# EAGLE design micro_schem (EAGLE 5.04)
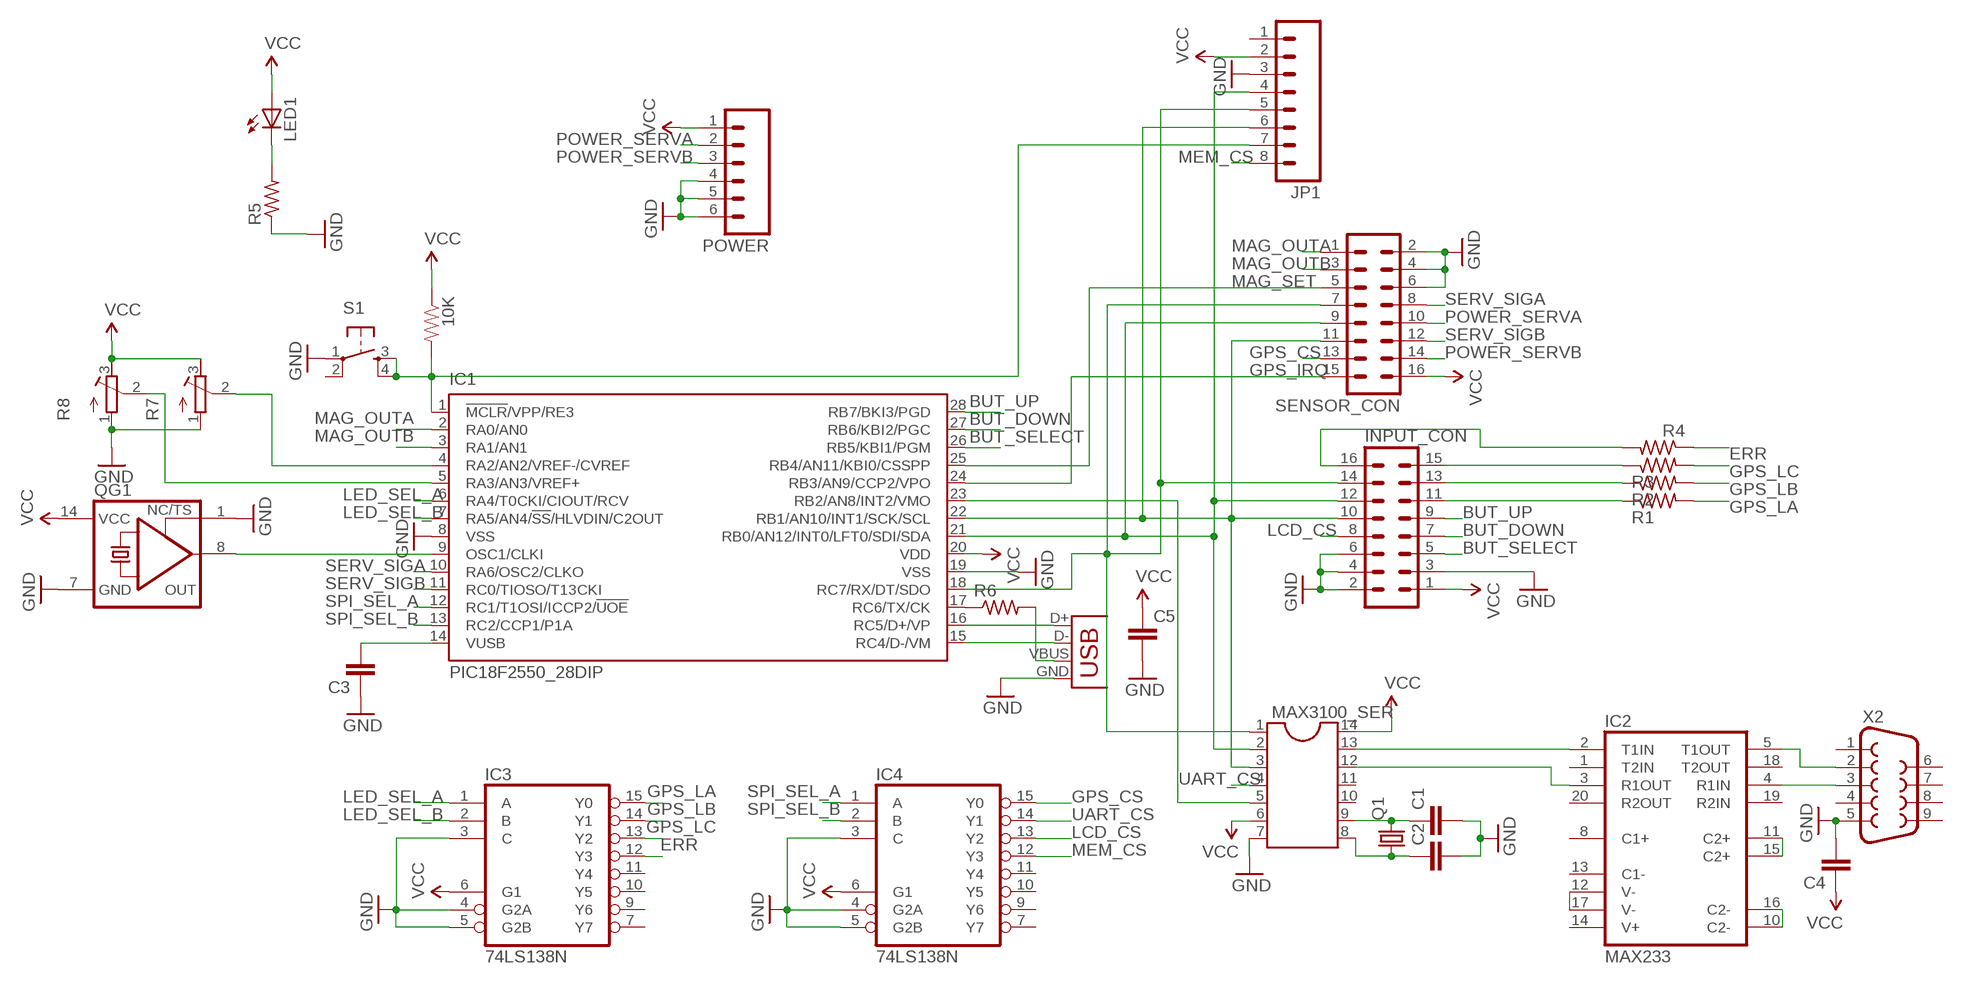
[diagram p0: schematic, sheet 1]

## Parts
10K  RESISTORPTH1  [AXIAL-0.3]
C1  CAPPTH  [CAP-PTH-SMALL]
C2  CAPPTH  [CAP-PTH-SMALL]
C3  CAPPTH  [CAP-PTH-SMALL]
C4  CAPPTH2  [CAP-PTH-SMALL2]
C5  CAPPTH  [CAP-PTH-SMALL]
IC1  PIC18F2550_28DIP  [DIL28-3]
IC2  MAX233  [DIL20]
IC3  74LS138N  [DIL16]
IC4  74LS138N  [DIL16]
INPUT_CON  MA08-2  [MA08-2]
JP1  M08  [1X08]
LED1  LED5MM  [LED5MM]
MAX3100_SER  DIL14S  [SOCKET-14]
POWER  M06SIP  [1X06]
Q1  CRYSTALHC49US  [HC49US]
QG1  XO-14  [DIL14S]
R1  R-US_0207/7  [0207/7]
R2  R-US_0207/7  [0207/7]
R3  R-US_0207/7  [0207/7]
R4  R-US_0207/7  [0207/7]
R5  R-US_0204/7  [0204/7]
R6  R-US_0204/7  [0204/7]
R7  R-TRIMM74W  [RTRIM74W]
R8  R-TRIMM74W  [RTRIM74W]
S1  TAC_SWITCHPTH  [TACTILE-PTH]
SENSOR_CON  MA08-2  [MA08-2]
X1  USBPTH  [USB-B-PTH]
X2  DB9  [DB9]

## Nets
BUT_DOWN: IC1.27(RB6/KBI2/PGC) INPUT_CON.7
BUT_SELECT: IC1.26(RB5/KBI1/PGM) INPUT_CON.5
BUT_UP: IC1.28(RB7/BKI3/PGD) INPUT_CON.9
ERR: IC3.12(Y3) R4.1
GND: C1.2 C2.2 C3.1 C4.2 C5.2 IC1.8(VSS) IC1.19(VSS) IC3.3(C) IC3.4(G2A) IC3.5(G2B) IC4.3(C) IC4.4(G2A) IC4.5(G2B) INPUT_CON.2 INPUT_CON.3 INPUT_CON.4 INPUT_CON.6 JP1.3 MAX3100_SER.7 POWER.4 POWER.5 POWER.6 QG1.1(TS) QG1.7(GND) R5.1 R7.1(E) R8.1(E) S1.1 SENSOR_CON.2 SENSOR_CON.4 SENSOR_CON.6 X1.GND X2.5
GPS_CS: IC4.15(Y0) SENSOR_CON.13
GPS_IRQ: IC1.24(RB3/AN9/CCP2/VPO) SENSOR_CON.15
GPS_LA: IC3.15(Y0) R1.2
GPS_LB: IC3.14(Y1) R2.2
GPS_LC: IC3.13(Y2) R3.2
LCD_CS: IC4.13(Y2) INPUT_CON.8
LED_SEL_A: IC1.6(RA4/T0CKI/CIOUT/RCV) IC3.1(A)
LED_SEL_B: IC1.7(RA5/AN4/!SS!/HLVDIN/C2OUT) IC3.2(B)
MAG_OUTA: IC1.2(RA0/AN0) SENSOR_CON.1
MAG_OUTB: IC1.3(RA1/AN1) SENSOR_CON.3
MAG_SET: IC1.25(RB4/AN11/KBI0/CSSPP) SENSOR_CON.5
MEM_CS: IC4.12(Y3) JP1.8
N$1: INPUT_CON.11 R1.1
N$2: R6.2 X1.VBUS
N$3: IC1.22(RB1/AN10/INT1/SCK/SCL) INPUT_CON.10 JP1.6 MAX3100_SER.3 SENSOR_CON.11
N$4: IC1.21(RB0/AN12/INT0/LFT0/SDI/SDA) INPUT_CON.12 JP1.4 MAX3100_SER.2 SENSOR_CON.9
N$5: IC1.18(RC7/RX/DT/SDO) INPUT_CON.14 JP1.5 MAX3100_SER.1 SENSOR_CON.7
N$6: C1.1 MAX3100_SER.9 Q1.2
N$7: C2.1 MAX3100_SER.8 Q1.1
N$8: IC2.12(V-) IC2.17(V-)
N$9: IC1.16(RC5/D+/VP) X1.D+
N$10: IC1.15(RC4/D-/VM) X1.D-
N$11: IC2.10(C2-) IC2.16(C2-)
N$12: IC2.11(C2+) IC2.15(C2+)
N$13: IC2.5(T1OUT) X2.2
N$14: IC2.4(R1IN) X2.3
N$15: IC2.2(T1IN) MAX3100_SER.13
N$16: IC2.3(R1OUT) MAX3100_SER.12
N$17: C3.2 IC1.14(VUSB)
N$18: INPUT_CON.13 R2.1
N$19: INPUT_CON.15 R3.1
N$20: INPUT_CON.16 R4.2
N$24: IC1.23(RB2/AN8/INT2/VMO) MAX3100_SER.5
N$25: IC1.9(OSC1/CLKI) QG1.8(OUT)
N$26: LED1.K(C) R5.2
N$27: IC1.17(RC6/TX/CK) R6.1
N$29: IC1.4(RA2/AN2/VREF-/CVREF) R7.2(S)
N$30: IC1.5(RA3/AN3/VREF+) R8.2(S)
N$31: 10K.P$2 IC1.1(!MCLR!/VPP/RE3) JP1.7 S1.3 S1.4
POWER_SERVA [servo_power]: POWER.2 SENSOR_CON.10
POWER_SERVB [servo_power]: POWER.3 SENSOR_CON.14
SERV_SIGA: IC1.10(RA6/OSC2/CLKO) SENSOR_CON.8
SERV_SIGB: IC1.11(RC0/TIOSO/T13CKI) SENSOR_CON.12
SPI_SEL_A: IC1.12(RC1/T1OSI/ICCP2/!UOE) IC4.1(A)
SPI_SEL_B: IC1.13(RC2/CCP1/P1A) IC4.2(B)
UART_CS: IC4.14(Y1) MAX3100_SER.4
VCC [power]: 10K.P$1 C4.1 C5.1 IC1.20(VDD) IC3.6(G1) IC4.6(G1) INPUT_CON.1 JP1.2 LED1.A MAX3100_SER.6 MAX3100_SER.14 POWER.1 QG1.14(VCC) R7.3(A) R8.3(A) SENSOR_CON.16
Unconnected: IC2.1(T2IN) IC2.8(C1+) IC2.13(C1-) IC2.14(V+) IC2.18(T2OUT) IC2.19(R2IN) IC2.20(R2OUT) IC3.7(Y7) IC3.9(Y6) IC3.10(Y5) IC3.11(Y4) IC4.7(Y7) IC4.9(Y6) IC4.10(Y5) IC4.11(Y4) JP1.1 MAX3100_SER.10 MAX3100_SER.11 S1.2 X2.1 X2.4 X2.6 X2.7 X2.8 X2.9

## Power pins joined to a net without a drawn wire
GND: IC2.6(GND) IC2.9(GND) IC3.8(GND) IC4.8(GND)
VCC: IC2.7(VCC) IC3.16(VCC) IC4.16(VCC)

## Library data of the parts
10K = SparkFun:RESISTOR: Resistor Basic schematic elements and footprints for 0603, 1206, and PTH 1/10th watt (small) resistors.
C1-C5 = SparkFun:CAP: Capacitor Standard 0603 ceramic capacitor, and 0.1" leaded capacitor.
IC1 = microchip:PIC18F2*_28: USB Microcontrollers with nanoWatt Technology High-Performance, Enhanced Flash, 28/40/44-Pin, Source: http://ww1.microchip.com/downloads/en/devicedoc/39632c.pdf
IC2 = maxim:MAX233: RS232 TRANSEIVER
IC3 IC4 = 74xx-us:74*138: 3-line to 8-line DECODER/DEMULTIPLEXER
INPUT_CON SENSOR_CON = con-lstb:MA08-2: PIN HEADER
JP1 = SparkFun:M08: Header 8 Standard 8-pin 0.1" header. Use with straight break away headers (SKU : PRT-00116), right angle break away headers (PRT-00553), swiss pins (PRT-00743), machine pins (PRT-00117), and female headers (PRT-00115).
LED1 = led:LED: LED OSRAM: - CHIPLED LG R971, LG N971, LY N971, LG Q971, LY Q971, LO R971, LY R971 LH N974, LH R974 LS Q976, LO Q976, LY Q976 LO Q996 - Hyper CHIPLED LW Q18S LB Q993, LB Q99A, LB R99A - SideLED LS A670, LO A670, LY A670, LG A670, LP A670 LB A673, LV A673, LT A673, LW A673 LH A674 LY A675 LS A676, LA A676, LO A676, LY A676, LW A676 LS A679, LY A679, LG A679 - Hyper Micro SIDELED® LS Y876, LA Y876, LO Y876, LY Y876 LT Y87S - SmartLED LW L88C, LW L88S LB L89C, LB L89S, LG L890 LS L89K, LO L89K, LY L89K LS L896, LA L896, LO L896, LY L896 - TOPLED LS T670, LO T670, LY T670, LG T670, LP T670 LSG T670, LSP T670, LSY T670, LOP T670, LYG T670 LG T671, LOG T671, LSG T671 LB T673, LV T673, LT T673, LW T673 LH T674 LS T676, LA T676, LO T676, LY T676, LB T676, LH T676, LSB T676, LW T676 LB T67C, LV T67C, LT T67C, LS T67K, LO T67K, LY T67K, LW E67C LS E67B, LA E67B, LO E67B, LY E67B, LB E67C, LV E67C, LT E67C LW T67C LS T679, LY T679, LG T679 LS T770, LO T770, LY T770, LG T770, LP T770 LB T773, LV T773, LT T773, LW T773 LH T774 LS E675, LA E675, LY E675, LS T675 LS T776, LA T776, LO T776, LY T776, LB T776 LHGB T686 LT T68C, LB T68C - Hyper Mini TOPLED® LB M676 - Mini TOPLED Santana® LG M470 LS M47K, LO M47K, LY M47K Source: http://www.osram.convergy.de LUXEON: - LUMILED® LXK2-PW12-R00, LXK2-PW12-S00, LXK2-PW14-U00, LXK2-PW14-V00 LXK2-PM12-R00, LXK2-PM12-S00, LXK2-PM14-U00 LXK2-PE12-Q00, LXK2-PE12-R00, LXK2-PE12-S00, LXK2-PE14-T00, LXK2-PE14-U00 LXK2-PB12-K00, LXK2-PB12-L00, LXK2-PB12-M00, LXK2-PB14-N00, LXK2-PB14-P00, LXK2-PB14-Q00 LXK2-PR12-L00, LXK2-PR12-M00, LXK2-PR14-Q00, LXK2-PR14-R00 LXK2-PD12-Q00, LXK2-PD12-R00, LXK2-PD12-S00 LXK2-PH12-R00, LXK2-PH12-S00 LXK2-PL12-P00, LXK2-PL12-Q00, LXK2-PL12-R00 Source: www.luxeon.com KINGBRIGHT: KA-3528ASYC Source: www.kingbright.com
MAX3100_SER = ic-package:DIL14: Dual In Line / Socket
POWER = SparkFun:M06: Header 6 Standard 6-pin 0.1" header. Use with straight break away headers (SKU : PRT-00116), right angle break away headers (PRT-00553), swiss pins (PRT-00743), machine pins (PRT-00117), and female headers (PRT-00115). Molex polarized connector foot print use with SKU : PRT-08094 with associated crimp pins and housings. NOTES ON THE VARIANTS LOCK and LOCK_LONGPADS... This footprint was designed to help hold the alignment of a through-hole component (i.e. 6-pin header) while soldering it into place. You may notice that each hole has been shifted either up or down by 0.005 of an inch from it's more standard position (which is a perfectly straight line). This slight alteration caused the pins (the squares in the middle) to touch the edges of the holes. Because they are alternating, it causes a "brace" to hold the component in place. 0.005 has proven to be the perfect amount of "off-center" position when using our standard breakaway headers. Although looks a little odd when you look at the bare footprint, once you have a header in there, the alteration is very hard to notice. Also, if you push a header all the way into place, it is covered up entirely on the bottom side. This idea of altering the position of holes to aid alignment will be further integrated into the Sparkfun Library for other footprints. It can help hold any component with 3 or more connection pins.
Q1 = SparkFun:CRYSTAL: Crystals Various standard crystals. Proven footprints. Spark Fun Electronics SKU : COM-00534
QG1 = crystal:XO-: CRYSTAL
R1-R6 = resistor:R-US_: RESISTOR, American symbol
R7 R8 = resistor:R-TRIMM: Trimm resistor
S1 = SparkFun:TAC_SWITCH: Momentary Switch Button commonly used for reset or general input. Spark Fun Electronics SKU : COM-00097
X1 = SparkFun:USB: USB Connectors USB-B-PTH is fully proven SKU : PRT-00139 USB-miniB is fully proven SKU : PRT-00587 USB-A-PCB is untested. USB-A-H is throughly reviewed, but untested. Spark Fun Electronics SKU : PRT-00437 USB-B-SMT is throughly reviewed, but untested. Needs silkscreen touching up. USB-A-S has not been used/tested USB-MB-H has not been used/tested
X2 = SparkFun:DB9: DB9 Connector Standard DB9 (D-Sub 9) serial connector. Can be used for CAN bus as well as RS485 and RS232. Footprint production proven. Spark Fun Electronics SKU : PRT-00429

## Net classes
1 servo_power: width 0.305 mm
2 power: width 0.279 mm

## Board
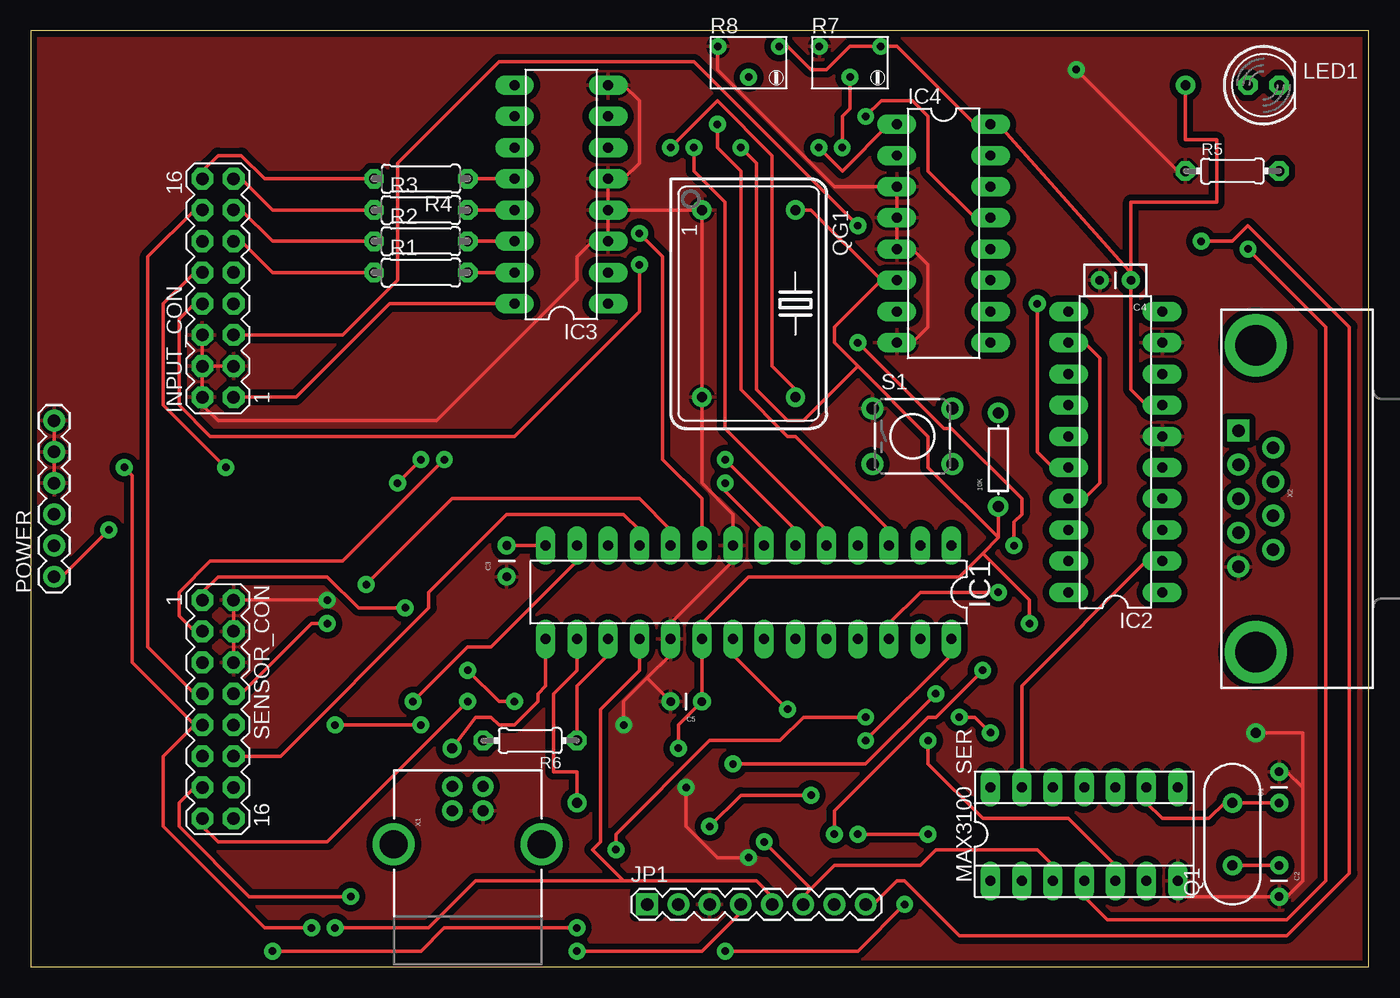
[diagram p1: board, top side]
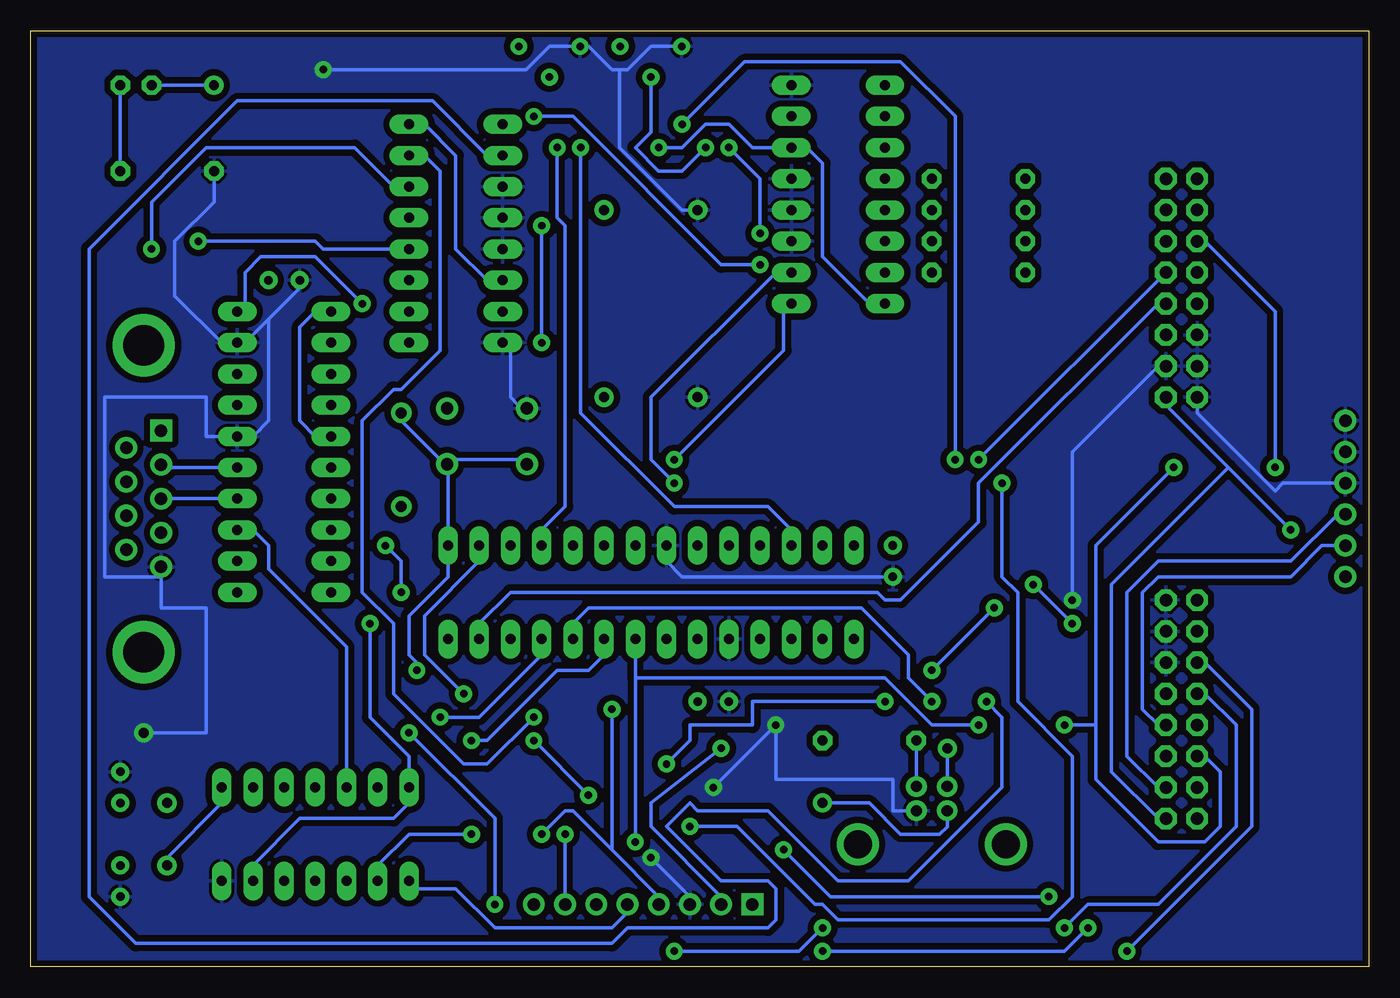
[diagram p2: board, bottom side, seen from below]

Size 108.89 x 76.19 mm. Coordinates in mm from the lower left corner, seen from the top.
Outline: 0,0 108.89,0 108.89,76.19 0,76.19 0,0
Copper layers (1*16): Top 0.035mm / dielectric 1.5mm / Bottom 0.035mm
Design rules "default *": minimum track width 12mil, minimum drill 24mil, track to track 20mil, track to pad 20mil, pad to pad 8mil, via to via 8mil, smd to smd 8mil, copper to edge 20mil, drill to drill 8mil, minimum pad ring 15mil, minimum via ring 15mil, stop-mask expansion 4mil, vias tented up to drill 0mil, thermal gap 10mil
vRestrict: area 95.9,21 to 108.6,54.6; area 83.2,27.9 to 93.3,58.4; area 75.6,3.8 to 102.9,17.8; area 27.9,-0.6 to 43.2,17.1; area 36.2,17.1 to 45.7,20.3; area 36.8,25.4 to 77.5,35.6; area 50.8,42.5 to 66,65.4; area 67.3,38.7 to 76.2,47.6; area 69.8,48.3 to 78.7,71.1; area 54,70.5 to 71.1,76.2; area 38.7,51.4 to 47.6,74.3; area 27.3,54 to 36.2,66.7; 7 more areas

### Footprints (pad centres in the part's own frame; a part is rotated, then mirrored left to right if it is on the bottom)
AXIAL-0.3 = drill 0.9 round: P$1 -3.81,0; P$2 3.81,0
CAP-PTH-SMALL = drill 0.7 round: 1 0,0; 2 2.54,0
CAP-PTH-SMALL2 = drill 0.7 round: 1 0,0; 2 2.54,0
DIL28-3 = drill 0.813 long: 1 -16.51,-3.81; 2 -13.97,-3.81; 3 -11.43,-3.81; 4 -8.89,-3.81; 5 -6.35,-3.81; 6 -3.81,-3.81; 7 -1.27,-3.81; 8 1.27,-3.81; 9 3.81,-3.81; 10 6.35,-3.81; 11 8.89,-3.81; 12 11.43,-3.81; 13 13.97,-3.81; 14 16.51,-3.81; 15 16.51,3.81; 16 13.97,3.81; 17 11.43,3.81; 18 8.89,3.81; 19 6.35,3.81; 20 3.81,3.81; 21 1.27,3.81; 22 -1.27,3.81; 23 -3.81,3.81; 24 -6.35,3.81; 25 -8.89,3.81; 26 -11.43,3.81; 27 -13.97,3.81; 28 -16.51,3.81
DIL20 = drill 0.813 long: 1 -11.43,-3.81; 2 -8.89,-3.81; 3 -6.35,-3.81; 4 -3.81,-3.81; 5 -1.27,-3.81; 6 1.27,-3.81; 7 3.81,-3.81; 8 6.35,-3.81; 9 8.89,-3.81; 10 11.43,-3.81; 11 11.43,3.81; 12 8.89,3.81; 13 6.35,3.81; 14 3.81,3.81; 15 1.27,3.81; 16 -1.27,3.81; 17 -3.81,3.81; 18 -6.35,3.81; 19 -8.89,3.81; 20 -11.43,3.81
DIL16 = drill 0.813 long: 1 -8.89,-3.81; 2 -6.35,-3.81; 3 -3.81,-3.81; 4 -1.27,-3.81; 5 1.27,-3.81; 6 3.81,-3.81; 7 6.35,-3.81; 8 8.89,-3.81; 9 8.89,3.81; 10 6.35,3.81; 11 3.81,3.81; 12 1.27,3.81; 13 -1.27,3.81; 14 -3.81,3.81; 15 -6.35,3.81; 16 -8.89,3.81
MA08-2 = drill 1.016 octagon: 1 -8.89,-1.27; 2 -8.89,1.27; 3 -6.35,-1.27; 4 -6.35,1.27; 5 -3.81,-1.27; 6 -3.81,1.27; 7 -1.27,-1.27; 8 -1.27,1.27; 9 1.27,-1.27; 10 1.27,1.27; 11 3.81,-1.27; 12 3.81,1.27; 13 6.35,-1.27; 14 6.35,1.27; 15 8.89,-1.27; 16 8.89,1.27
1X08 = drill 1.016 square: 1 0,0 | drill 1.016 round: 2 2.54,0; 3 5.08,0; 4 7.62,0; 5 10.16,0; 6 12.7,0; 7 15.24,0; 8 17.78,0
LED5MM = drill 0.813 octagon: A -1.27,0; K 1.27,0
SOCKET-14 = drill 0.813 long: 1 -7.62,-3.81; 2 -5.08,-3.81; 3 -2.54,-3.81; 4 0,-3.81; 5 2.54,-3.81; 6 5.08,-3.81; 7 7.62,-3.81; 8 7.62,3.81; 9 5.08,3.81; 10 2.54,3.81; 11 0,3.81; 12 -2.54,3.81; 13 -5.08,3.81; 14 -7.62,3.81
1X06 = drill 1.016 round: 1 0,0; 2 2.54,0; 3 5.08,0; 4 7.62,0; 5 10.16,0; 6 12.7,0
HC49US = drill 0.813 round: 1 -2.54,0; 2 2.54,0
DIL14S = drill 0.813 round: 1 -7.62,-3.81; 7 7.62,-3.81; 8 7.62,3.81; 14 -7.62,3.81
0207/7 = drill 0.813 octagon: 1 -3.81,0; 2 3.81,0
0204/7 = drill 0.813 octagon: 1 -3.81,0; 2 3.81,0
RTRIM74W = drill 0.61 round: 1 -1.25,-2.5; 2 1.25,0; 3 -1.25,2.5
TACTILE-PTH = drill 1.016 round: 1 -3.251,2.261; 2 3.251,2.261; 3 -3.251,-2.261; 4 3.251,-2.261
USB-B-PTH = drill 0.914 round: D+ 0,1.25; D- 1.981,1.25; GND 0,-1.25; VBUS 1.981,-1.25 | drill 2.286 round: P$1 -2.718,-6.02; P$2 -2.718,6.02
DB9 = drill 1.016 square: 1 -5.54,-1.42 | drill 1.016 round: 2 -2.77,-1.42; 3 0,-1.42; 4 2.77,-1.42; 5 5.54,-1.42; 6 -4.15,1.42; 7 -1.38,1.42; 8 1.38,1.42; 9 4.15,1.42 | drill 3.302 pad 5.08 round: G1 -12.5,0; G2 12.5,0

### Placement (x,y rotation side)
10K  78.74,41.27 90 top
C1  101.6,13.34 90 top
C2  101.6,8.26 270 top
C3  38.73,31.75 90 top
C4  89.53,55.88 180 top
C5  54.61,21.59 180 top
IC1  58.42,30.48 180 top
IC2  88.27,41.91 90 top
IC3  43.18,62.87 90 top
IC4  74.3,59.69 270 top
INPUT_CON  15.24,55.24 90 top
JP1  50.16,5.08 0 top
LED1  100.33,71.75 0 top
MAX3100_SER  85.72,10.79 0 top
POWER  1.91,31.75 90 top
Q1  97.79,10.79 90 top
QG1  58.42,53.98 270 top
R1  31.75,56.52 0 top
R2  31.75,59.05 0 top
R3  31.75,61.59 0 top
R4  31.75,64.14 180 top
R5  97.79,64.77 0 top
R6  40.64,18.41 180 top
R7  66.67,73.66 270 top
R8  58.42,73.66 270 top
S1  71.75,43.18 0 top
SENSOR_CON  15.24,20.95 270 top
X1  35.56,12.7 90 top
X2  99.69,38.1 270 top

### Tracks (layer width: path | path; a pad name or v marks a point on that pad's centre or on a via)
BUT_DOWN
  Bottom 0.305: IC1.27 72.39,27.94 69.85,30.48 40.01,30.48 39.37,29.84 38.1,29.84 31.75,36.2 31.75,39.37 17.14,53.98 INPUT_CON.7
BUT_SELECT  (via drill 0.61)
  Top 0.305: v78.74,30.48 72.39,30.48 69.85,27.94 IC1.26 | v80.01,34.29 80.01,36.2 80.64,36.83 80.64,38.1 74.93,43.81 74.3,43.81 v67.31,50.8 | v67.31,60.33 53.98,73.66 38.1,73.66 29.84,65.41 29.84,55.88 25.4,51.44 INPUT_CON.5
  Bottom 0.305: v78.74,30.48 78.74,33.02 v80.01,34.29 | v67.31,60.33 v67.31,50.8
BUT_UP  (via drill 0.61)
  Top 0.305: v67.94,18.41 74.93,25.4 IC1.28 | v63.5,13.97 57.78,13.97 v55.24,11.43 | v29.84,39.37 v31.75,41.27
  Bottom 0.305: v63.5,13.97 v67.94,18.41 | v55.24,11.43 51.44,11.43 45.09,5.08 44.45,5.08 43.18,3.81 26.04,3.81 24.13,5.71 24.13,17.14 28.57,21.59 28.57,30.48 29.84,31.75 v29.84,39.37 | v31.75,41.27 INPUT_CON.9
ERR
  Top 0.305: R4.1 IC3.12
GND  (via drill 0.61, 0.8)
  Top 0.305: MAX3100_SER.7 93.34,5.71 C2.2 102.23,5.71 103.5,6.99 103.5,14.61 | 103.5,14.61 102.23,15.88 C1.2 | 103.5,14.61 103.5,19.05 v99.69,19.05 | v48.26,19.68 48.26,21.59 50.16,23.5 | 50.16,23.5 52.07,25.4 IC1.19 52.07,27.94 57.15,33.02 IC1.8 57.15,36.83 54.61,39.37 QG1.7 QG1.1 IC3.4 | v58.42,8.89 55.88,8.89 53.34,11.43 v53.34,14.61 | SENSOR_CON.6 SENSOR_CON.4 SENSOR_CON.2 v24.13,29.84 | POWER.4 POWER.5 POWER.6 | INPUT_CON.4 INPUT_CON.2 13.97,45.72 15.24,44.45 33.02,44.45 44.45,55.88 44.45,57.78 45.72,59.05 IC3.3 IC3.4 | INPUT_CON.3 INPUT_CON.4 | INPUT_CON.4 INPUT_CON.6 | IC4.8 71.75,50.8 73.03,52.07 73.03,57.15 71.75,58.42 IC4.5 IC4.4 IC4.3 65.41,63.5 55.88,73.03 55.88,74.3 R8.1 | IC3.4 IC3.5 48.26,64.14 49.53,65.41 49.53,70.48 48.26,71.75 IC3.8 | v85.09,73.03 93.34,64.77 R5.1 | 50.16,23.5 C5.2
  Bottom 0.305: 89.53,52.7 91.44,50.8 IC2.9 93.34,50.8 97.16,54.61 97.16,59.05 93.98,62.23 R5.1 | 89.53,52.7 87,55.24 C4.2 | 89.53,52.7 89.53,44.45 90.81,43.18 IC2.6 94.61,43.18 94.61,46.35 102.87,46.35 102.87,31.75 98.28,31.75 | C3.1 55.88,31.75 57.15,33.02 IC1.8 | X1.GND 38.73,12.7 38.73,15.24 48.26,15.24 v48.26,19.68 v53.34,14.61 | v58.42,8.89 55.24,5.71 JP1.3 | POWER.4 6.99,39.37 7.62,38.73 13.97,45.09 INPUT_CON.2 | v24.13,29.84 24.13,41.91 17.14,48.9 INPUT_CON.3 | IC4.8 69.85,50.16 69.85,46.35 69.22,45.72 S1.1 | 60.96,73.03 61.59,73.03 63.5,74.93 R7.1 64.77,74.93 66.67,74.93 68.58,73.03 v85.09,73.03 | 60.96,73.03 60.33,73.03 58.42,74.93 56.52,74.93 R8.1 | 60.96,73.03 60.96,66.67 55.88,61.59 QG1.1 | 98.28,31.75 98.28,29.21 94.61,29.21 94.61,19.05 v99.69,19.05 | 98.28,31.75 X2.5
  pour Bottom: 0,76.2 108.58,76.2 108.58,0 0,0
  pour Top: 0,76.2 108.58,76.2 108.58,0 0,0
GPS_CS  (via drill 0.61)
  Top 0.305: v67.94,20.32 62.87,20.32 60.96,18.41 55.24,18.41 47.62,10.79 v47.62,9.53 | v26.04,5.71 17.78,5.71 12.06,11.43 12.06,13.34 13.34,14.61 SENSOR_CON.13
  Bottom 0.305: v67.94,20.32 71.75,16.51 73.66,16.51 79.38,22.23 79.38,27.94 81.92,30.48 81.92,44.45 79.38,46.99 78.74,46.99 75.56,50.16 75.56,64.77 76.83,66.04 IC4.15 | v47.62,9.53 43.81,5.71 v26.04,5.71
GPS_IRQ  (via drill 0.61)
  Top 0.305: v35.56,21.59 24.13,10.16 15.24,10.16 13.97,11.43 SENSOR_CON.15
  Bottom 0.305: v35.56,21.59 37.47,23.5 37.47,25.4 41.27,29.21 63.5,29.21 64.77,27.94 IC1.24
GPS_LA
  Top 0.305: R1.2 IC3.15
GPS_LB
  Top 0.305: R2.2 IC3.14
GPS_LC
  Top 0.305: R3.2 IC3.13
LCD_CS  (via drill 0.61)
  Top 0.305: v67.94,69.22 69.22,70.48 71.75,70.48 73.03,69.22 73.03,64.77 76.83,60.96 IC4.13 | v49.53,57.15 49.53,53.34 39.37,43.18 14.61,43.18 12.06,45.72 12.06,52.7 13.34,53.98 INPUT_CON.8
  Bottom 0.305: v67.94,69.22 64.77,69.22 52.7,57.15 v49.53,57.15
LED_SEL_A  (via drill 0.61)
  Top 0.305: v56.52,41.27 62.23,35.56 IC1.6
  Bottom 0.305: v56.52,41.27 47.62,50.16 47.62,53.34 IC3.1
LED_SEL_B  (via drill 0.61)
  Top 0.305: v56.52,39.37 56.52,38.73 59.69,35.56 IC1.7
  Bottom 0.305: v56.52,39.37 58.42,41.27 58.42,46.35 48.26,56.52 IC3.2
MAG_OUTA  (via drill 0.61)
  Top 0.305: v73.66,22.23 67.94,16.51 v57.15,16.51 | v39.37,21.59 38.1,21.59 v35.56,24.13 | v30.48,29.21 26.67,29.21 24.13,31.75 15.24,31.75 13.97,30.48 SENSOR_CON.1
  Bottom 0.305: v73.66,22.23 76.83,25.4 76.83,28.57 72.39,33.02 IC1.2 | v39.37,21.59 50.16,21.59 50.16,19.68 55.24,19.68 55.24,18.41 v57.15,16.51 | v30.48,29.21 v35.56,24.13
MAG_OUTB  (via drill 0.61)
  Top 0.305: v55.88,68.58 55.88,66.67 57.78,64.77 57.78,46.99 61.59,43.18 62.23,43.18 69.85,35.56 IC1.3 | v33.66,41.27 25.4,33.02 14.61,33.02 12.06,30.48 12.06,28.57 13.34,27.3 SENSOR_CON.3
  Bottom 0.305: v55.88,68.58 50.8,73.66 38.1,73.66 33.66,69.22 v33.66,41.27
MAG_SET  (via drill 0.61)
  Top 0.305: v75.56,20.32 76.83,20.32 v78.11,19.05 | v71.12,5.08 67.31,1.27 v56.52,1.27 | v44.45,3.17 33.66,3.17 31.75,1.27 v19.68,1.27
  Bottom 0.305: v75.56,20.32 72.39,20.32 67.31,25.4 IC1.25 | v78.11,19.05 71.12,12.06 v71.12,5.08 | v56.52,1.27 46.35,1.27 v44.45,3.17 | v19.68,1.27 9.53,11.43 9.53,20.95 13.34,24.77 SENSOR_CON.5
MEM_CS  (via drill 0.61)
  Top 0.305: v95.25,59.05 97.79,59.05 99.06,60.33 107.31,52.07 107.31,7.62 102.23,2.54 75.56,2.54 71.12,6.99 70.48,6.99 68.58,5.08 JP1.8
  Bottom 0.305: v95.25,59.05 85.72,59.05 85.09,58.42 IC4.12
N$1
  Top 0.305: R1.1 19.68,56.52 17.14,59.05 INPUT_CON.11
N$2
  Bottom 0.305: X1.VBUS 36.83,14.68 R6.2
N$3  (via drill 0.61)
  Top 0.305: 63.5,6.35 62.87,5.71 JP1.6 | 63.5,6.35 65.41,8.26 72.39,8.26 73.66,9.53 81.92,9.53 83.19,8.26 MAX3100_SER.3 | v59.69,10.16 63.5,6.35 | v15.88,40.64 10.79,45.72 10.79,53.98 13.34,56.52 INPUT_CON.10 | v24.77,19.68 v31.75,19.68
  Bottom 0.305: 59.69,23.5 v59.69,10.16 | 59.69,23.5 IC1.22 | 22.23,19.68 22.23,34.29 v15.88,40.64 | 22.23,19.68 22.23,15.24 17.14,10.16 13.34,10.16 12.06,11.43 12.06,15.88 13.34,17.14 SENSOR_CON.11 | 59.69,23.5 39.37,23.5 35.56,19.68 v31.75,19.68 | 22.23,19.68 v24.77,19.68
N$4  (via drill 0.61)
  Top 0.305: 13.34,19.68 8.26,24.77 8.26,40.01 v7.62,40.64 | v67.31,10.79 v73.03,10.79 | v61.59,20.95 57.15,25.4 IC1.21 | 13.34,19.68 10.79,17.14 10.79,11.43 19.05,3.17 v22.86,3.17 | v44.45,1.27 54.61,1.27 57.78,4.45 JP1.4 | 13.34,19.68 SENSOR_CON.9
  Bottom 0.305: v7.62,40.64 7.62,53.34 13.34,59.05 INPUT_CON.12 | v73.03,10.79 78.11,10.79 80.64,8.26 MAX3100_SER.2 | v67.31,10.79 65.41,12.7 64.77,12.7 61.59,9.53 | 61.59,9.53 57.78,5.71 JP1.4 | 61.59,9.53 v61.59,20.95 | v22.86,3.17 24.77,1.27 v44.45,1.27
N$5  (via drill 0.61)
  Top 0.305: SENSOR_CON.7 13.34,22.23 9.53,26.04 9.53,57.78 13.34,61.59 INPUT_CON.14 | 48.26,6.99 45.72,9.53 46.35,10.16 46.35,20.95 49.53,24.13 IC1.18 | 48.26,6.99 59.05,6.99 60.33,5.71 JP1.5 | v24.77,3.17 32.38,3.17 36.2,6.99 48.26,6.99
  Bottom 0.305: MAX3100_SER.1 77.47,6.35 74.3,6.35 71.12,3.17 61.59,3.17 60.33,4.45 JP1.5 | v24.77,3.17 22.86,5.08 17.14,5.08 10.79,11.43 10.79,19.68 13.34,22.23 SENSOR_CON.7
N$6
  Top 0.305: C1.1 Q1.2 97.16,13.34 95.89,12.06 92.08,12.06 90.81,13.34 MAX3100_SER.9
N$7
  Top 0.305: Q1.1 C2.1
  Bottom 0.305: MAX3100_SER.8 93.34,13.34 97.79,8.89 Q1.1
N$8
  Top 0.305: IC2.17 85.72,38.1 87,39.37 87,49.53 85.72,50.8 IC2.12
N$9  (via drill 0.8)
  Top 0.305: IC1.16 44.45,24.13 42.55,22.23 42.55,15.88 44.45,15.88 v44.45,13.34
  Bottom 0.305: X1.D+ 34.31,11.41 34.92,10.79 38.1,10.79 40.64,13.34 v44.45,13.34
N$10  (via drill 0.8)
  Top 0.305: IC1.15 41.91,22.86 41.27,22.23 41.27,21.59 39.37,19.68 38.1,19.68 37.47,20.32 36.2,20.32 v34.29,17.78
  Bottom 0.305: X1.D- 34.29,14.68 v34.29,17.78
N$11  (via drill 0.61)
  Top 0.305: v81.92,53.98 81.92,41.91 83.19,40.64 IC2.16
  Bottom 0.305: v81.92,53.98 85.72,57.78 90.17,57.78 91.44,56.52 91.44,53.98 IC2.10
N$12
  Bottom 0.305: IC2.15 85.72,43.18 87,44.45 87,52.07 85.72,53.34 IC2.11
N$13
  Bottom 0.305: X2.2 98.28,40.64 IC2.5
N$14
  Bottom 0.305: IC2.4 X2.3
N$15
  Top 0.305: MAX3100_SER.13 80.64,22.86 90.81,33.02 IC2.2
N$16
  Bottom 0.305: MAX3100_SER.12 83.19,26.04 89.53,32.38 89.53,34.29 90.81,35.56 IC2.3
N$17
  Top 0.305: C3.2 IC1.14
N$18
  Top 0.305: R2.1 19.68,59.05 17.14,61.59 INPUT_CON.13
N$19
  Top 0.305: R3.1 19.68,61.59 17.14,64.14 INPUT_CON.15
N$20
  Top 0.305: R4.2 19.05,64.14 17.14,66.04 15.24,66.04 13.97,64.77 INPUT_CON.16
N$21
  pour Bottom: 0,76.2 109.22,76.2 109.22,0 0,0
N$24  (via drill 0.61)
  Top 0.305: v73.03,18.41 73.03,16.51 77.47,12.06 84.45,12.06 88.27,8.26 MAX3100_SER.5
  Bottom 0.305: v73.03,18.41 71.75,18.41 66.04,24.13 63.5,24.13 62.23,25.4 IC1.23
N$25  (via drill 0.61)
  Top 0.305: v49.53,59.69 51.44,57.78 51.44,41.27 54.61,38.1 IC1.9 | v52.07,66.67 55.88,70.48 60.33,66.04 60.33,48.9 62.23,46.99 QG1.8
  Bottom 0.305: v49.53,59.69 49.53,64.14 v52.07,66.67
N$26
  Bottom 0.305: R5.2 LED1.K
N$27
  Top 0.305: R6.1 44.45,22.86 46.99,25.4 IC1.17
N$29  (via drill 0.61)
  Top 0.305: v66.04,66.67 66.04,69.22 66.67,69.85 R7.2
  Bottom 0.305: v66.04,66.67 66.04,60.96 65.41,60.33 65.41,37.47 67.31,35.56 IC1.4
N$30  (via drill 0.61)
  Top 0.305: v53.98,66.67 53.98,64.77 56.52,62.23 56.52,43.81 64.77,35.56 IC1.5
  Bottom 0.305: v53.98,66.67 55.88,64.77 57.78,64.77 59.69,66.67 58.42,67.94 R8.2
N$31  (via drill 0.61)
  Top 0.305: v65.41,10.79 65.41,12.7 73.03,20.32 73.66,20.32 v77.47,24.13
  Bottom 0.305: S1.4 74.93,40.64 IC1.1 74.93,31.75 78.11,28.57 78.11,25.4 77.47,24.77 v77.47,24.13 | 10K.P$2 78.74,44.45 75.56,41.27 S1.4 | JP1.7 v65.41,10.79 | S1.3 69.22,41.27 74.3,41.27 S1.4
POWER_SERVA
  Bottom 0.305: POWER.2 3.81,34.29 6.35,31.75 17.14,31.75 18.41,30.48 18.41,20.95 17.14,19.68 SENSOR_CON.10
POWER_SERVB
  Bottom 0.305: POWER.3 2.54,36.83 6.35,33.02 17.14,33.02 19.68,30.48 19.68,17.14 17.14,14.61 SENSOR_CON.14
SERV_SIGA  (via drill 0.61)
  Top 0.305: v27.3,31.11 34.29,38.1 49.53,38.1 52.07,35.56 IC1.10 | v24.13,27.94 22.86,27.94 17.14,22.23 SENSOR_CON.8
  Bottom 0.305: v24.13,27.94 v27.3,31.11
SERV_SIGB
  Top 0.305: IC1.11 49.53,35.56 48.26,36.83 38.73,36.83 32.38,30.48 32.38,29.21 20.32,17.14 SENSOR_CON.12
SPI_SEL_A  (via drill 0.61)
  Top 0.305: v64.14,66.67 66.04,64.77 69.85,68.58 IC4.1
  Bottom 0.305: v64.14,66.67 64.14,45.09 56.52,37.47 48.9,37.47 46.99,35.56 IC1.12
SPI_SEL_B  (via drill 0.61)
  Top 0.305: v31.11,21.59 35.56,26.04 37.47,26.04 44.45,33.02 IC1.13
  Bottom 0.305: v31.11,21.59 29.84,20.32 29.84,14.61 37.47,6.99 43.18,6.99 48.9,12.7 54.61,12.7 55.24,13.34 57.15,11.43 52.7,6.99 48.9,6.99 48.26,6.35 48.26,3.81 48.9,3.17 60.33,3.17 61.59,1.91 100.33,1.91 104.14,5.71 104.14,58.42 92.08,70.48 76.2,70.48 71.75,66.04 IC4.2
UART_CS  (via drill 0.61)
  Top 0.305: v99.06,58.42 105.41,52.07 105.41,6.99 102.23,3.81 87.63,3.81 85.72,5.71 MAX3100_SER.4
  Bottom 0.305: v99.06,58.42 99.06,62.23 94.61,66.67 82.55,66.67 79.38,63.5 IC4.14
VCC  (via drill 0.61, 0.8)
  Top 0.305: v6.35,35.56 2.54,31.75 POWER.1 | IC3.16 29.21,53.98 21.59,46.35 INPUT_CON.1 | C4.1 89.53,46.99 90.81,45.72 IC2.7 | C4.1 89.53,56.52 88.9,57.15 78.74,68.58 IC4.16 76.83,68.58 70.48,74.93 69.85,74.93 R7.3 68.58,74.93 66.67,74.93 64.77,73.03 63.5,73.03 61.59,74.93 R8.3 | 69.22,55.88 63.5,61.59 QG1.14 | 78.74,34.92 77.47,33.66 | 77.47,33.66 75.56,31.75 58.42,31.75 54.61,27.94 IC1.20 C5.1 52.7,19.68 v52.7,17.78 | 78.74,34.92 10K.P$1 | v81.28,27.94 81.28,29.84 77.47,33.66 | 69.22,55.88 65.41,52.07 65.41,50.8 67.31,48.9 | 67.31,48.9 73.03,43.18 73.03,40.64 78.74,34.92 | 69.22,55.88 IC4.6 | v57.78,66.67 59.05,65.41 59.05,46.99 61.59,44.45 62.87,44.45 67.31,48.9 | v93.98,71.75 93.98,67.31 96.52,67.31 96.52,62.23 89.53,62.23 C4.1
  Bottom 0.305: IC3.16 40.64,53.98 44.45,57.78 44.45,65.41 45.72,66.67 IC3.6 50.16,66.67 52.07,68.58 53.98,68.58 55.88,66.67 v57.78,66.67 | 11.43,40.64 16.51,45.72 INPUT_CON.1 | 11.43,40.64 v6.35,35.56 | 11.43,40.64 20.95,31.11 20.95,15.88 17.14,12.06 SENSOR_CON.16 | IC4.6 71.75,55.88 74.3,58.42 74.3,66.04 76.83,68.58 IC4.16 | MAX3100_SER.6 90.81,8.26 87,12.06 79.38,12.06 78.11,13.34 MAX3100_SER.14 78.11,17.14 81.28,20.32 v81.28,27.94 | v52.7,17.78 58.42,13.34 58.42,11.43 52.7,5.71 JP1.2 | v93.98,71.75 LED1.A